# EAGLE design OttoPi04b (EAGLE 9.6.2)
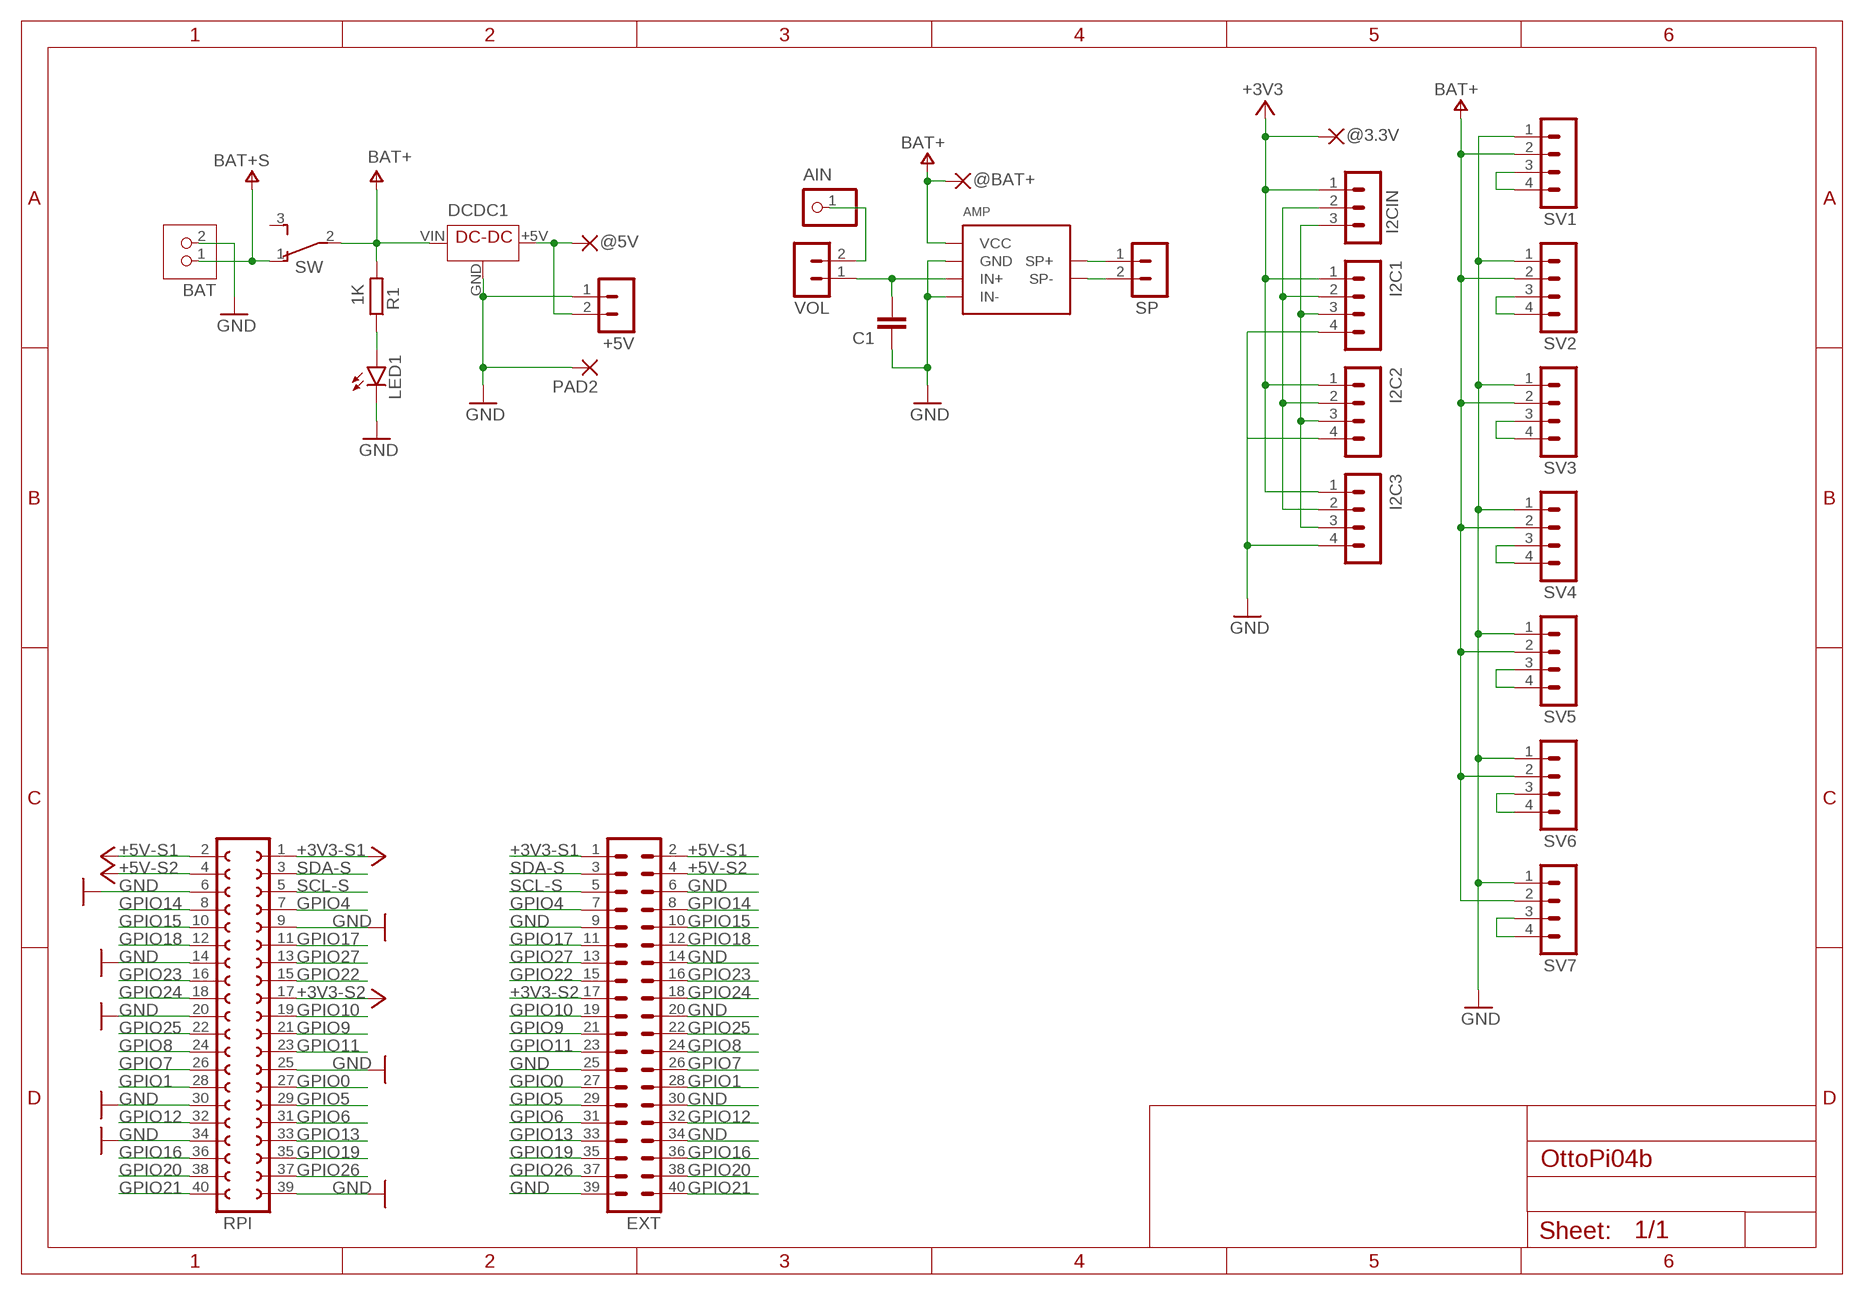
[diagram p0: schematic, sheet 1]

## Parts
+5V  MA02-1  [MA02-1]
@3.3V  1,6/0,9  [1,6/0,9]
@5V  1,6/0,9  [1,6/0,9]
@BAT+  1,6/0,9  [1,6/0,9]
AIN  PINHD-1X1  [1X01]
AMP  PAM8012MOD  [PAM8012MOD-A]
BAT  JST-PH2  [JST-PH2]
C1  C-EU025-024X044  [C025-024X044]
DCDC1  DCDC-5V-0.48A  [DCDC-5V-0.48A]
EXT  MA20-2  [MA20-2]
I2C1  MA04-1  [MA04-1]
I2C2  MA04-1  [MA04-1]
I2C3  MA04-1  [MA04-1]
I2CIN  MA03-1  [MA03-1]
LED1  LED3MM  [LED3MM]
PAD2  1,6/0,9  [1,6/0,9]
R1  1K  R-EU_0204/7  [0204/7]
RPI  FE20-2  [FE20-2]
SP  MA02-1  [MA02-1]
SV1  MA04-1  [MA04-1]
SV2  MA04-1  [MA04-1]
SV3  MA04-1  [MA04-1]
SV4  MA04-1  [MA04-1]
SV5  MA04-1  [MA04-1]
SV6  MA04-1  [MA04-1]
SV7  MA04-1  [MA04-1]
SW  TL36PO  [TL3XPO]
VOL  MA02-1  [MA02-1]

## Nets
+3V3: @3.3V.1(P) I2C1.1 I2C2.1 I2C3.1 I2CIN.1
+3V3-S1: EXT.1 RPI.1 ; supply symbol labelled +3V3
+3V3-S2: EXT.17 RPI.17 ; supply symbol labelled +3V3
+4V_S: BAT.1 SW.1(O) ; supply symbol labelled BAT+S
+5V: +5V.2 @5V.1(P) DCDC1.+5V(VOUT)
+5V-S1: EXT.2 RPI.2 ; supply symbol labelled +5V
+5V-S2: EXT.4 RPI.4 ; supply symbol labelled +5V
AIN: AMP.IN+ C1.1 VOL.1
GND: +5V.1 AMP.GND AMP.IN- BAT.2 C1.2 DCDC1.GND EXT.6 EXT.9 EXT.14 EXT.20 EXT.25 EXT.30 EXT.34 EXT.39 I2C1.4 I2C2.4 I2C3.4 LED1.K(C) PAD2.1(P) RPI.6 RPI.9 RPI.14 RPI.20 RPI.25 RPI.30 RPI.34 RPI.39 SV1.1 SV2.1 SV3.1 SV4.1 SV5.1 SV6.1 SV7.1
GPIO0: EXT.27 RPI.27
GPIO1: EXT.28 RPI.28
GPIO4: EXT.7 RPI.7
GPIO5: EXT.29 RPI.29
GPIO6: EXT.31 RPI.31
GPIO7: EXT.26 RPI.26
GPIO8: EXT.24 RPI.24
GPIO9: EXT.21 RPI.21
GPIO10: EXT.19 RPI.19
GPIO11: EXT.23 RPI.23
GPIO12: EXT.32 RPI.32
GPIO13: EXT.33 RPI.33
GPIO14: EXT.8 RPI.8
GPIO15: EXT.10 RPI.10
GPIO16: EXT.36 RPI.36
GPIO17: EXT.11 RPI.11
GPIO18: EXT.12 RPI.12
GPIO19: EXT.35 RPI.35
GPIO20: EXT.38 RPI.38
GPIO21: EXT.40 RPI.40
GPIO22: EXT.15 RPI.15
GPIO23: EXT.16 RPI.16
GPIO24: EXT.18 RPI.18
GPIO25: EXT.22 RPI.22
GPIO26: EXT.37 RPI.37
GPIO27: EXT.13 RPI.13
LED: LED1.A R1.1
N$1: AIN.1 VOL.2
N$4: SV6.3 SV6.4
N$5: SV7.3 SV7.4
SCL: I2C1.3 I2C2.3 I2C3.3 I2CIN.3
SCL-S: EXT.5 RPI.5
SDA-S: EXT.3 RPI.3
SDL: I2C1.2 I2C2.2 I2C3.2 I2CIN.2
SP+: AMP.SP+@1(SP+) SP.1
SP-: AMP.SP-@1(SP-) SP.2
SV1: SV5.3 SV5.4
SV2: SV4.3 SV4.4
SV3: SV3.3 SV3.4
SV4: SV2.3 SV2.4
SV5: SV1.3 SV1.4
V+: @BAT+.1(P) AMP.V+(VCC) DCDC1.VIN R1.2 SV1.2 SV2.2 SV3.2 SV4.2 SV5.2 SV6.2 SV7.2 SW.2(P) ; supply symbol labelled BAT+
Unconnected: SW.3(S)

## Library data of the parts
+5V SP VOL = ytani-con-lstb:MA02-1: PIN HEADER
@3.3V @5V @BAT+ PAD2 = wirepad:1,6/0,9: THROUGH-HOLE PAD
AIN = pinhead:PINHD-1X1: PIN HEADER
AMP = ytani1:PAM8012MOD: PAM8012使用2W D級アンプモジュール https://akizukidenshi.com/catalog/g/gK-08217/ Vin: 2.5V-5.5V 8ohm: 1W 4ohm: 2W IN-をGNDに接続することでシングルエンド入力としても使用できます。; CHIP1: PAM8012; OC_AKIZUKI: K-08217; URL_AKIZUKI: https://akizukidenshi.com/catalog/g/gK-08217/
BAT = ytani1:JST-PH2
C1 = rcl:C-EU: CAPACITOR, European symbol; SPICEPREFIX: C
DCDC1 = ytani1:DCDC-5V-0.48A: DC-DC step up converter T64 https://www.amazon.co.jp/gp/product/B07N8TBJB3/ Vin: 0.9V-5V Vout: 5V; URL_AMAZON: https://www.amazon.co.jp/gp/product/B07N8TBJB3/
EXT = con-lstb:MA20-2: PIN HEADER; OC_FARNELL: unknown; OC_NEWARK: unknown
I2C1-I2C3 SV1-SV7 = ytani-con-lstb:MA04-1: PIN HEADER; OC_FARNELL: unknown; OC_NEWARK: unknown
I2CIN = ytani-con-lstb:MA03-1: PIN HEADER; OC_FARNELL: unknown; OC_NEWARK: unknown
LED1 = led:LED: LED OSRAM: - CHIPLED LG R971, LG N971, LY N971, LG Q971, LY Q971, LO R971, LY R971 LH N974, LH R974 LS Q976, LO Q976, LY Q976 LO Q996 - Hyper CHIPLED LW Q18S LB Q993, LB Q99A, LB R99A - SideLED LS A670, LO A670, LY A670, LG A670, LP A670 LB A673, LV A673, LT A673, LW A673 LH A674 LY A675 LS A676, LA A676, LO A676, LY A676, LW A676 LS A679, LY A679, LG A679 - Hyper Micro SIDELED® LS Y876, LA Y876, LO Y876, LY Y876 LT Y87S - SmartLED LW L88C, LW L88S LB L89C, LB L89S, LG L890 LS L89K, LO L89K, LY L89K LS L896, LA L896, LO L896, LY L896 - TOPLED LS T670, LO T670, LY T670, LG T670, LP T670 LSG T670, LSP T670, LSY T670, LOP T670, LYG T670 LG T671, LOG T671, LSG T671 LB T673, LV T673, LT T673, LW T673 LH T674 LS T676, LA T676, LO T676, LY T676, LB T676, LH T676, LSB T676, LW T676 LB T67C, LV T67C, LT T67C, LS T67K, LO T67K, LY T67K, LW E67C LS E67B, LA E67B, LO E67B, LY E67B, LB E67C, LV E67C, LT E67C LW T67C LS T679, LY T679, LG T679 LS T770, LO T770, LY T770, LG T770, LP T770 LB T773, LV T773, LT T773, LW T773 LH T774 LS E675, LA E675, LY E675, LS T675 LS T776, LA T776, LO T776, LY T776, LB T776 LHGB T686 LT T68C, LB T68C - Hyper Mini TOPLED® LB M676 - Mini TOPLED Santana® LG M470 LS M47K, LO M47K, LY M47K Source: http://www.osram.convergy.de LUXEON: - LUMILED® LXK2-PW12-R00, LXK2-PW12-S00, LXK2-PW14-U00, LXK2-PW14-V00 LXK2-PM12-R00, LXK2-PM12-S00, LXK2-PM14-U00 LXK2-PE12-Q00, LXK2-PE12-R00, LXK2-PE12-S00, LXK2-PE14-T00, LXK2-PE14-U00 LXK2-PB12-K00, LXK2-PB12-L00, LXK2-PB12-M00, LXK2-PB14-N00, LXK2-PB14-P00, LXK2-PB14-Q00 LXK2-PR12-L00, LXK2-PR12-M00, LXK2-PR14-Q00, LXK2-PR14-R00 LXK2-PD12-Q00, LXK2-PD12-R00, LXK2-PD12-S00 LXK2-PH12-R00, LXK2-PH12-S00 LXK2-PL12-P00, LXK2-PL12-Q00, LXK2-PL12-R00 Source: www.luxeon.com KINGBRIGHT: KA-3528ASYC Source: www.kingbright.com
R1 = rcl:R-EU_: RESISTOR, European symbol; SPICEPREFIX: R
RPI = con-lsta:FE20-2: FEMALE HEADER; OC_FARNELL: unknown; OC_NEWARK: unknown
SW = switch:TL36PO: TINY SWITCH ON - ON Source: http://www2.produktinfo.conrad.com/datenblaetter/700000-724999/705152-da-01-de-Subminiaturschalter_TL_36YO.pdf

## Net classes
0 default: clearance 0.254 mm
1 V+: width 0.1 mm

## Board
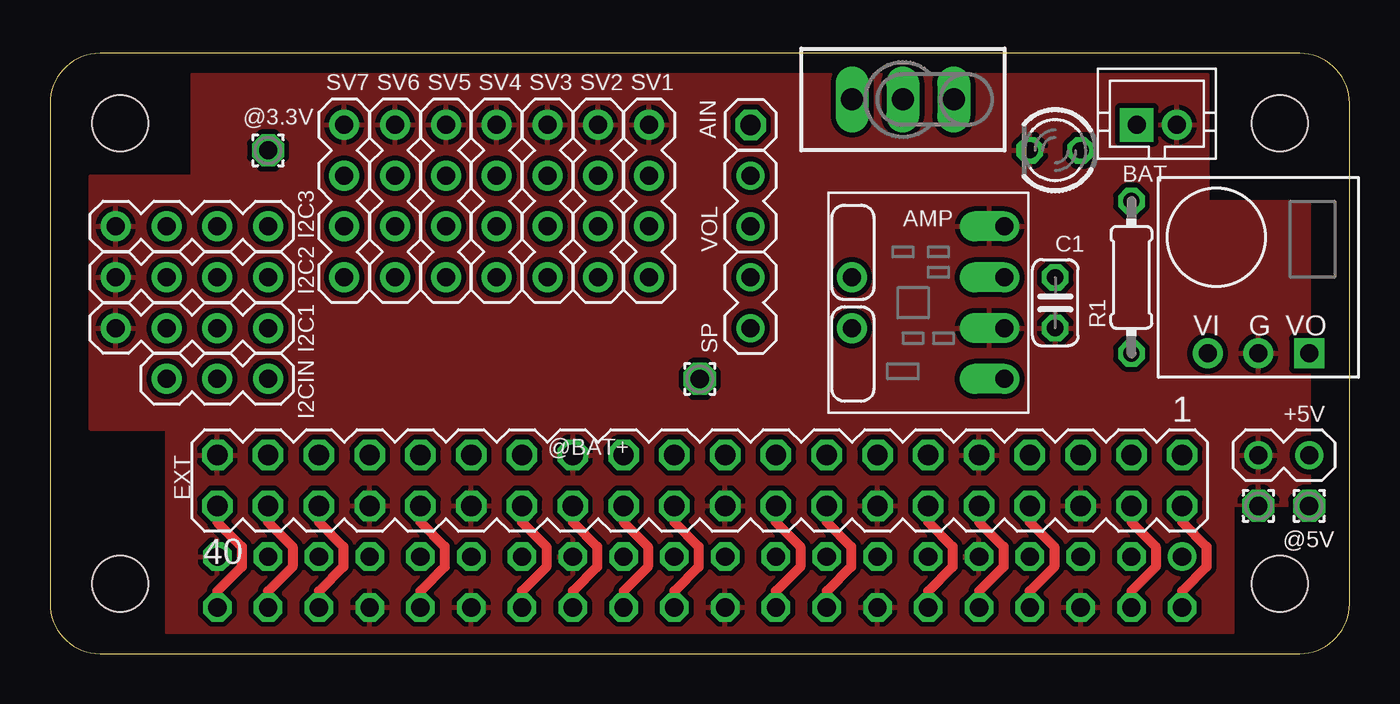
[diagram p1: board, top side]
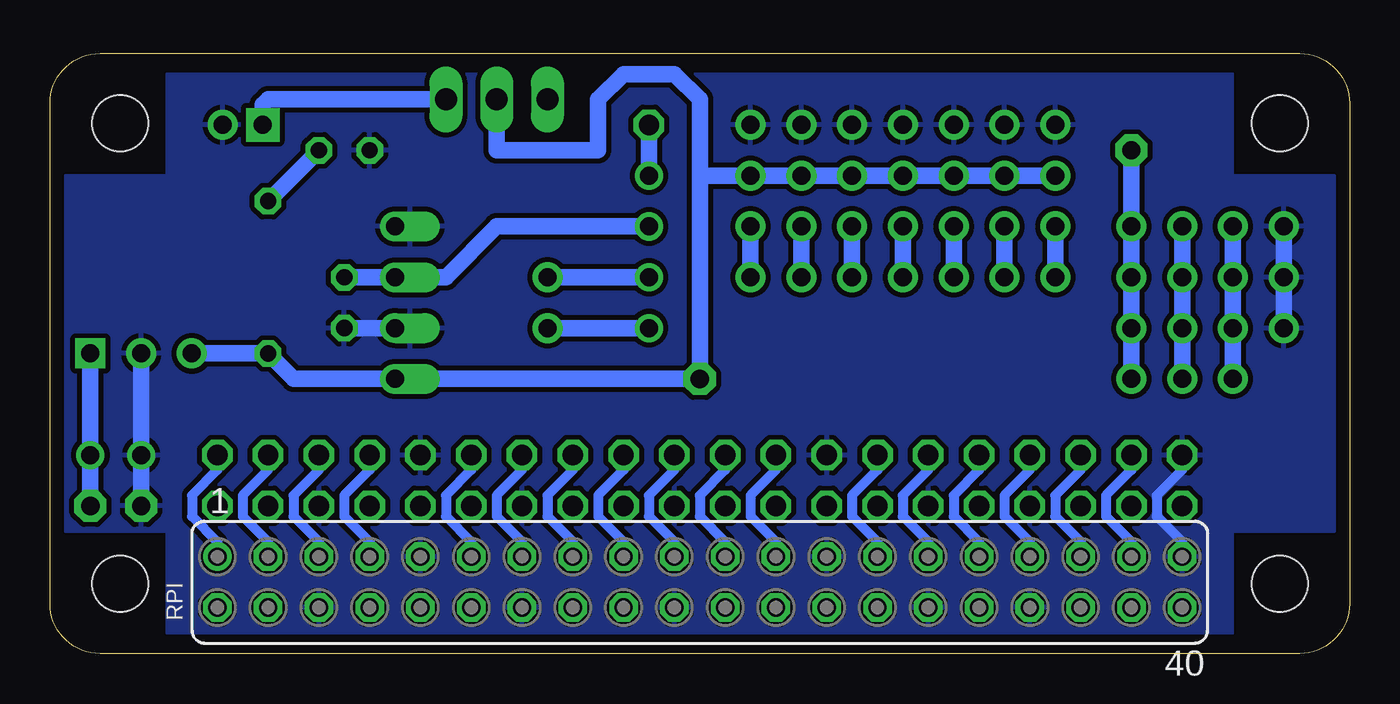
[diagram p2: board, bottom side, seen from below]

Size 65 x 30 mm. Coordinates in mm from the lower left corner, seen from the top.
Outline: 0,27.5 0,2.5 arc90 2.5,0 62.5,0 arc90 65,2.5 65,27.5 arc90 62.5,30 2.5,30 arc90 0,27.5
Copper layers (1*16): Top 0.035mm / dielectric 1.5mm / Bottom 0.035mm
Design rules "SeeedStudio_2layer_DRU_no_angle_20140221": minimum track width 6mil, minimum drill 12mil, track to track 6mil, track to pad 6mil, pad to pad 6mil, via to via 6mil, smd to smd 0mil, copper to edge 10mil, drill to drill 10mil, minimum pad ring 10mil, minimum via ring 6mil, stop-mask expansion 2mil, vias tented up to drill 100mil, thermal gap 10mil
Holes 2.8 mm at 3.5,3.5 61.5,3.5 3.5,26.5 61.5,26.5

### Footprints (pad centres in the part's own frame; a part is rotated, then mirrored left to right if it is on the bottom)
MA02-1 = drill 0.9: 1 -1.27,0; 2 1.27,0
1,6/0,9 = drill 0.914 pad 1.6 octagon: 1 0,0
1X01 = drill 1.016 octagon: 1 0,0
PAM8012MOD-A = drill 0.9 pad 1.5 offset: GND -3.81,1.27; IN+ -3.81,-1.27; IN- -3.81,-3.81; V+ -3.81,3.81 | drill 0.9 pad 1.5: SP+@1 3.81,1.27; SP-@1 3.81,-1.27
JST-PH2 = drill 0.9 pad 1.676 square: 1 -1,0 | drill 0.9 pad 1.5: 2 1,0
C025-024X044 = drill 0.813 octagon: 1 -1.27,0; 2 1.27,0
DCDC-5V-0.48A = drill 0.9 pad 1.5 square: +5V -2.54,3.81 | drill 0.9 pad 1.5: GND 0,3.81; VIN 2.54,3.81
MA20-2 = drill 1.016 octagon: 1 -24.13,-1.27; 2 -24.13,1.27; 3 -21.59,-1.27; 4 -21.59,1.27; 5 -19.05,-1.27; 6 -19.05,1.27; 7 -16.51,-1.27; 8 -16.51,1.27; 9 -13.97,-1.27; 10 -13.97,1.27; 11 -11.43,-1.27; 12 -11.43,1.27; 13 -8.89,-1.27; 14 -8.89,1.27; 15 -6.35,-1.27; 16 -6.35,1.27; 17 -3.81,-1.27; 18 -3.81,1.27; 19 -1.27,-1.27; 20 -1.27,1.27; 21 1.27,-1.27; 22 1.27,1.27; 23 3.81,-1.27; 24 3.81,1.27; 25 6.35,-1.27; 26 6.35,1.27; 27 8.89,-1.27; 28 8.89,1.27; 29 11.43,-1.27; 30 11.43,1.27; 31 13.97,-1.27; 32 13.97,1.27; 33 16.51,-1.27; 34 16.51,1.27; 35 19.05,-1.27; 36 19.05,1.27; 37 21.59,-1.27; 38 21.59,1.27; 39 24.13,-1.27; 40 24.13,1.27
MA04-1 = drill 0.9 pad 1.5: 1 -3.81,0; 2 -1.27,0; 3 1.27,0; 4 3.81,0
MA03-1 = drill 0.9 pad 1.5: 1 1.27,-1.27; 2 3.81,-1.27; 3 6.35,-1.27
LED3MM = drill 0.813 octagon: A -1.27,0; K 1.27,0
0204/7 = drill 0.813 octagon: 1 -3.81,0; 2 3.81,0
FE20-2 = drill 0.914: 1 -24.13,1.27 | drill 0.914 octagon: 2 -24.13,-1.27; 3 -21.59,1.27; 4 -21.59,-1.27; 5 -19.05,1.27; 6 -19.05,-1.27; 7 -16.51,1.27; 8 -16.51,-1.27; 9 -13.97,1.27; 10 -13.97,-1.27; 11 -11.43,1.27; 12 -11.43,-1.27; 13 -8.89,1.27; 14 -8.89,-1.27; 15 -6.35,1.27; 16 -6.35,-1.27; 17 -3.81,1.27; 18 -3.81,-1.27; 19 -1.27,1.27; 20 -1.27,-1.27; 21 1.27,1.27; 22 1.27,-1.27; 23 3.81,1.27; 24 3.81,-1.27; 25 6.35,1.27; 26 6.35,-1.27; 27 8.89,1.27; 28 8.89,-1.27; 29 11.43,1.27; 30 11.43,-1.27; 31 13.97,1.27; 32 13.97,-1.27; 33 16.51,1.27; 34 16.51,-1.27; 35 19.05,1.27; 36 19.05,-1.27; 37 21.59,1.27; 38 21.59,-1.27; 39 24.13,1.27; 40 24.13,-1.27
TL3XPO = drill 1.1 pad 1.422 long: 1 -2.54,0; 2 0,0; 3 2.54,0

### Placement (x,y rotation side)
+5V  61.71,9.92 0 top
@3.3V  10.91,25.16 0 top
@5V  62.98,7.38 0 top
@BAT+  32.5,13.73 180 top
AIN  35.04,26.43 0 top
AMP  43.93,17.54 180 top
BAT  55.36,26.43 0 top
C1  50.28,17.54 270 top
DCDC1  60.44,18.81 180 top
EXT  32.5,8.65 180 top
I2C1  7.1,16.27 180 top
I2C2  7.1,18.81 180 top
I2C3  7.1,21.35 180 top
I2CIN  12.18,12.46 180 top
LED1  50.28,25.16 180 top
PAD2  60.44,7.38 0 top
R1  54.09,18.81 270 top
RPI  32.5,3.57 0 bottom
SP  35.04,17.54 90 top
SV1  29.96,22.62 270 top
SV2  27.42,22.62 270 top
SV3  24.88,22.62 270 top
SV4  22.34,22.62 270 top
SV5  19.8,22.62 270 top
SV6  17.26,22.62 270 top
SV7  14.72,22.62 270 top
SW  42.66,27.7 180 top
VOL  35.04,22.62 90 top

### Tracks (layer width: path | path; a pad name or v marks a point on that pad's centre or on a via)
+3V3
  Bottom 0.813: I2CIN.1 I2C1.1 I2C2.1 I2C3.1 @3.3V.1
+3V3-S1
  Bottom 0.508: EXT.1 56.63,9.18 57.9,7.91 57.9,6.85 56.63,5.58 RPI.1
+3V3-S2
  Bottom 0.508: EXT.17 36.31,9.18 37.58,7.91 37.58,6.85 36.31,5.58 RPI.17
+4V_S
  Bottom 0.813: SW.1 54.09,27.7 54.36,27.43 BAT.1
+5V
  Bottom 0.813: DCDC1.+5V +5V.2 @5V.1
+5V-S1
  Top 0.508: EXT.2 56.63,6.56 57.85,5.35 57.85,4.34 56.63,3.12 RPI.2
+5V-S2
  Top 0.508: EXT.4 54.09,6.56 55.31,5.35 55.31,4.34 54.09,3.12 RPI.4
AIN
  Bottom 0.813: C1.1 AMP.IN+ 45.2,18.81 42.66,21.35 VOL.1
GND
  Bottom 0.508: EXT.39 8.37,9.18 9.64,7.91 9.64,6.85 8.37,5.58 RPI.39
  Bottom 0.813: C1.2 AMP.GND | DCDC1.GND +5V.1 PAD2.1 | I2C1.4 I2C2.4 I2C3.4
  pour Bottom: 0.75,23.89 5.83,23.89 5.83,28.97 59.17,28.97 59.17,23.89 64.25,23.89 64.25,6.11 59.17,6.11 59.17,1.03 5.83,1.03 5.83,6.11 0.75,6.11
  pour Top: 2.02,23.89 7.1,23.89 7.1,28.97 57.9,28.97 57.9,22.62 62.98,22.62 62.98,7.38 59.17,7.38 59.17,1.03 5.83,1.03 5.83,11.19 2.02,11.19
GPIO0
  Bottom 0.508: EXT.27 23.61,9.18 24.88,7.91 24.88,6.85 23.61,5.58 RPI.27
GPIO1
  Top 0.508: EXT.28 23.61,6.56 24.83,5.35 24.83,4.34 23.61,3.12 RPI.28
GPIO4
  Bottom 0.508: EXT.7 49.01,9.18 50.28,7.91 50.28,6.85 49.01,5.58 RPI.7
GPIO5
  Bottom 0.508: EXT.29 21.07,9.18 22.34,7.91 22.34,6.85 21.07,5.58 RPI.29
GPIO6
  Bottom 0.508: EXT.31 18.53,9.18 19.8,7.91 19.8,6.85 18.53,5.58 RPI.31
GPIO7
  Top 0.508: EXT.26 26.15,6.56 27.37,5.35 27.37,4.34 26.15,3.12 RPI.26
GPIO8
  Top 0.508: EXT.24 28.69,6.56 29.91,5.35 29.91,4.34 28.69,3.12 RPI.24
GPIO9
  Bottom 0.508: EXT.21 31.23,9.18 32.5,7.91 32.5,6.85 31.23,5.58 RPI.21
GPIO10
  Bottom 0.508: EXT.19 33.77,9.18 35.04,7.91 35.04,6.85 33.77,5.58 RPI.19
GPIO11
  Bottom 0.508: EXT.23 28.69,9.18 29.96,7.91 29.96,6.85 28.69,5.58 RPI.23
GPIO12
  Top 0.508: EXT.32 18.53,6.56 19.75,5.35 19.75,4.34 18.53,3.12 RPI.32
GPIO13
  Bottom 0.508: EXT.33 15.99,9.18 17.26,7.91 17.26,6.85 15.99,5.58 RPI.33
GPIO14
  Top 0.508: EXT.8 49.01,6.56 50.23,5.35 50.23,4.34 49.01,3.12 RPI.8
GPIO15
  Top 0.508: EXT.10 46.47,6.56 47.69,5.35 47.69,4.34 46.47,3.12 RPI.10
GPIO16
  Top 0.508: EXT.36 13.45,6.56 14.67,5.35 14.67,4.34 13.45,3.12 RPI.36
GPIO17
  Bottom 0.508: EXT.11 43.93,9.18 45.2,7.91 45.2,6.85 43.93,5.58 RPI.11
GPIO18
  Top 0.508: EXT.12 43.93,6.56 45.15,5.35 45.15,4.34 43.93,3.12 RPI.12
GPIO19
  Bottom 0.508: EXT.35 13.45,9.18 14.72,7.91 14.72,6.85 13.45,5.58 RPI.35
GPIO20
  Top 0.508: EXT.38 10.91,6.56 12.13,5.35 12.13,4.34 10.91,3.12 RPI.38
GPIO21
  Top 0.508: EXT.40 8.37,6.56 9.59,5.35 9.59,4.34 8.37,3.12 RPI.40
GPIO22
  Bottom 0.508: EXT.15 38.85,9.18 40.12,7.91 40.12,6.85 38.85,5.58 RPI.15
GPIO23
  Top 0.508: EXT.16 38.85,6.56 40.07,5.35 40.07,4.34 38.85,3.12 RPI.16
GPIO24
  Top 0.508: EXT.18 36.31,6.56 37.53,5.35 37.53,4.34 36.31,3.12 RPI.18
GPIO25
  Top 0.508: EXT.22 31.23,6.56 32.45,5.35 32.45,4.34 31.23,3.12 RPI.22
GPIO26
  Bottom 0.508: EXT.37 10.91,9.18 12.18,7.91 12.18,6.85 10.91,5.58 RPI.37
GPIO27
  Bottom 0.508: EXT.13 41.39,9.18 42.66,7.91 42.66,6.85 41.39,5.58 RPI.13
LED
  Bottom 0.813: R1.1 LED1.A
N$1
  Bottom 0.813: VOL.2 AIN.1
N$4
  Bottom 0.813: SV6.3 SV6.4
N$5
  Bottom 0.813: SV7.4 SV7.3
SCL
  Bottom 0.813: I2CIN.3 I2C1.3 I2C2.3 I2C3.3
SCL-S
  Bottom 0.508: EXT.5 51.55,9.18 52.82,7.91 52.82,6.85 51.55,5.58 RPI.5
SDA-S
  Bottom 0.508: EXT.3 54.09,9.18 55.36,7.91 55.36,6.85 54.09,5.58 RPI.3
SDL
  Bottom 0.813: I2CIN.2 I2C1.2 I2C2.2 I2C3.2
SP+
  Bottom 0.813: AMP.SP+@1 SP.1
SP-
  Bottom 0.813: AMP.SP-@1 SP.2
SV1
  Bottom 0.813: SV5.4 SV5.3
SV2
  Bottom 0.813: SV4.4 SV4.3
SV3
  Bottom 0.813: SV3.3 SV3.4
SV4
  Bottom 0.813: SV2.4 SV2.3
SV5
  Bottom 0.813: SV1.4 SV1.3
V+
  Bottom 0.813: DCDC1.VIN R1.2 52.82,13.73 AMP.V+ @BAT+.1 32.5,23.89 | 32.5,23.89 SV1.2 SV2.2 SV3.2 SV4.2 SV5.2 SV6.2 SV7.2 | SW.2 42.66,25.16 37.58,25.16 37.58,27.7 36.31,28.97 33.77,28.97 32.5,27.7 32.5,23.89